# EAGLE design deska (EAGLE 9.3.0)
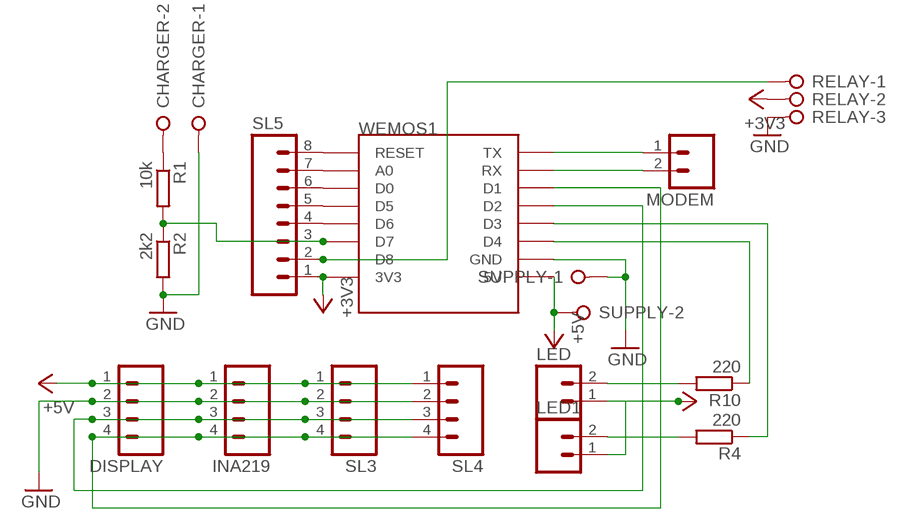
[diagram p0: schematic, sheet 1]

## Parts
CHARGER  W237-02P  [W237-132]
DISPLAY  M04  [04P]
INA219  M04  [04P]
LED  M02  [02P]
LED1  M02  [02P]
MODEM  M02  [02P]
R1  10k  R-EU_0207/10  [0207/10]
R2  2k2  R-EU_0207/10  [0207/10]
R4  220  R-EU_0207/10  [0207/10]
R10  220  R-EU_0207/10  [0207/10]
RELAY  W237-3E  [W237-3E]
SL3  M04  [04P]
SL4  M04  [04P]
SL5  M08  [08P]
SUPPLY  W237-02P  [W237-132]
WEMOS1  WEMOS-D1-MINI  [WEMOS-D1-MINI]

## Nets
+3V3: RELAY.2 SL5.1 WEMOS1.3V3
+5V: DISPLAY.1 INA219.1 LED1.1 LED.1 SL3.1 SL4.1 SUPPLY.2 WEMOS1.5V
GND: CHARGER.1 DISPLAY.2 INA219.2 R2.2 RELAY.3 SL3.2 SL4.2 SUPPLY.1 WEMOS1.GND
N$1: DISPLAY.4 INA219.4 SL3.4 SL4.4 WEMOS1.D1
N$2: DISPLAY.3 INA219.3 SL3.3 SL4.3 WEMOS1.D2
N$3: SL5.7 WEMOS1.A0
N$4: RELAY.1 SL5.2 WEMOS1.D8
N$5: CHARGER.2 R1.1
N$7: SL5.4 WEMOS1.D6
N$8: SL5.5 WEMOS1.D5
N$9: SL5.6 WEMOS1.D0
N$10: R1.2 R2.1 SL5.3 WEMOS1.D7
N$11: R10.1 WEMOS1.D4
N$12: LED.2 R10.2
N$13: SL5.8 WEMOS1.RESET
N$14: MODEM.1 WEMOS1.TX
N$15: MODEM.2 WEMOS1.RX
N$16: LED1.2 R4.2
N$17: R4.1 WEMOS1.D3

## Library data of the parts
CHARGER SUPPLY = con-wago-508:W237-02P: WAGO SREW CLAMP; OC_FARNELL: unknown; OC_NEWARK: unknown
DISPLAY INA219 SL3 SL4 = con-amp-quick:M04: AMP QUICK CONNECTOR; OC_FARNELL: unknown; OC_NEWARK: unknown
LED LED1 MODEM = con-amp-quick:M02: AMP QUICK CONNECTOR; OC_FARNELL: unknown; OC_NEWARK: unknown
R1 R2 R4 R10 = rcl:R-EU_: RESISTOR, European symbol
RELAY = con-wago-508:W237-3E: WAGO SREW CLAMP; OC_FARNELL: unknown; OC_NEWARK: unknown
SL5 = con-amp-quick:M08: AMP QUICK CONNECTOR; OC_FARNELL: unknown; OC_NEWARK: unknown
WEMOS1 = esp8266modules:WEMOS-D1-MINI: WeMos.cc D1 mini ESP8266 module

## Board
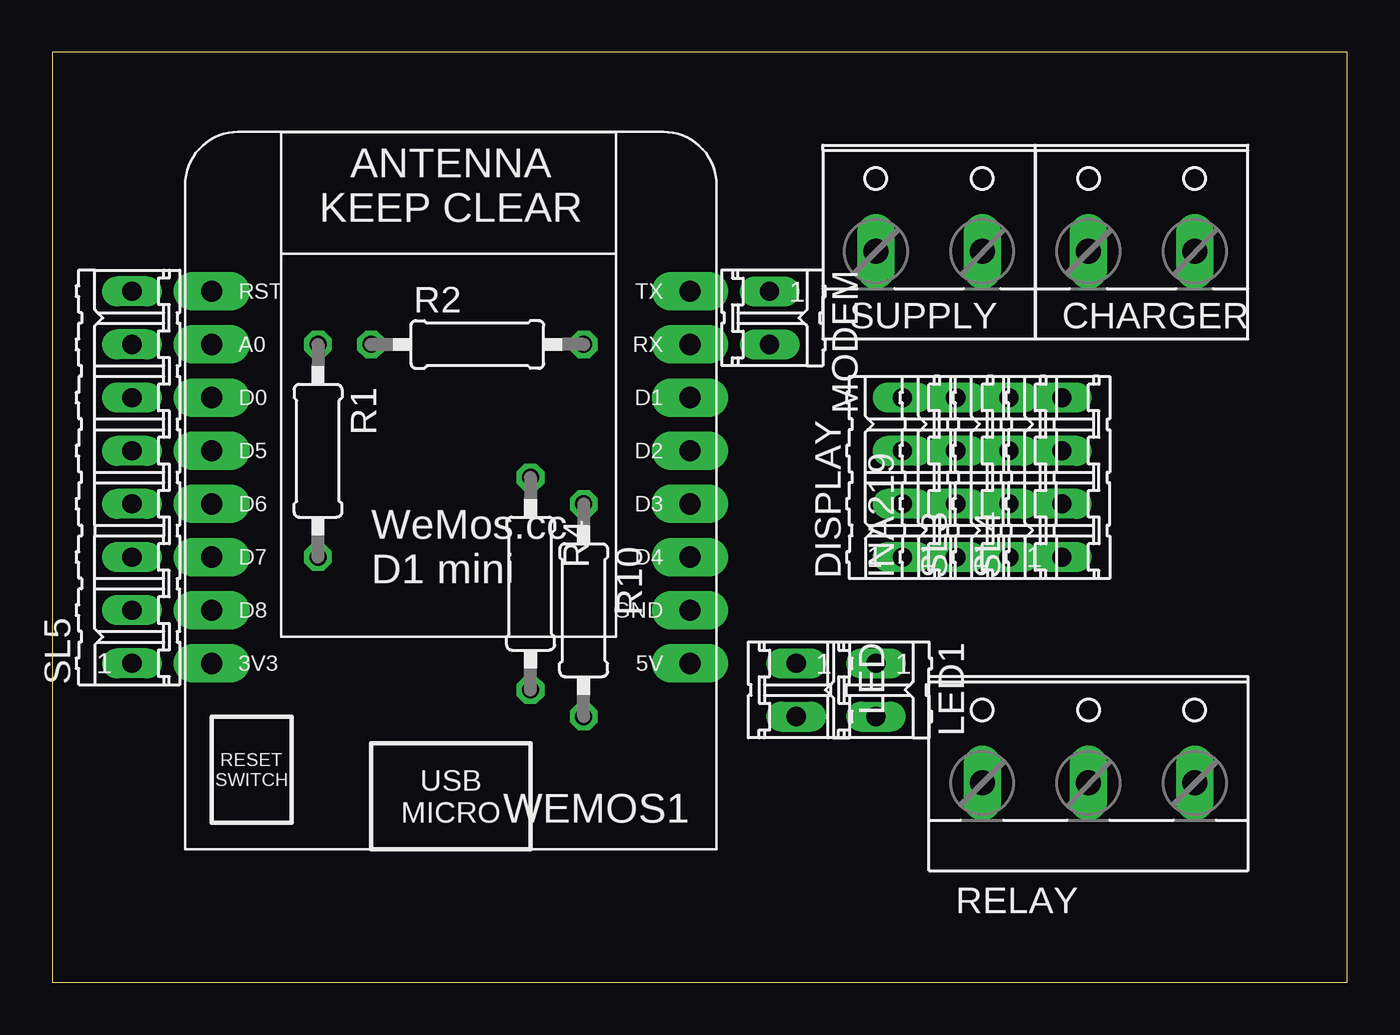
[diagram p1: board, top side]
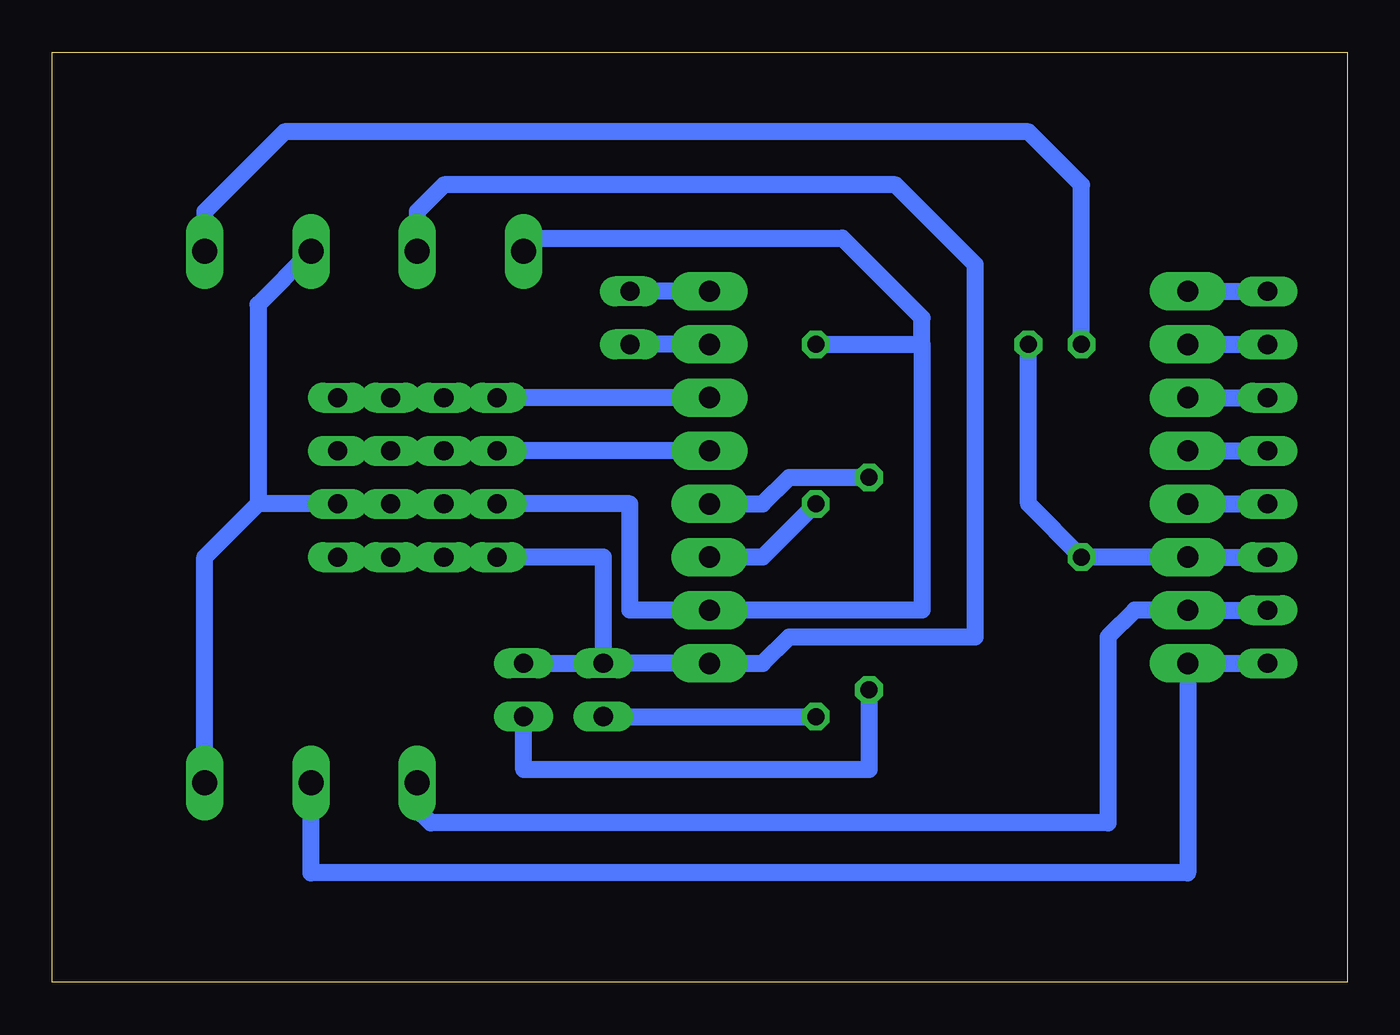
[diagram p2: board, bottom side, seen from below]

Size 61.9 x 44.44 mm. Coordinates in mm from the lower left corner, seen from the top.
Outline: 0,0 61.9,0 61.9,44.44 0,44.44 0,0
Copper layers (1*16): Top 0.035mm / dielectric 1.5mm / Bottom 0.035mm
Design rules "default": minimum track width 6mil, minimum drill 0.35mm, track to track 6mil, track to pad 6mil, pad to pad 6mil, via to via 6mil, smd to smd 6mil, copper to edge 40mil, drill to drill 6mil, minimum pad ring 10mil, minimum via ring 8mil, stop-mask expansion 4mil, vias tented up to drill 0mil, thermal gap 10mil

### Footprints (pad centres in the part's own frame; a part is rotated, then mirrored left to right if it is on the bottom)
W237-132 = drill 1.194 long: 1 -2.54,-0.635; 2 2.54,-0.635
04P = drill 0.914 long: 1 -3.81,0; 2 -1.27,0; 3 1.27,0; 4 3.81,0
02P = drill 0.914 long: 1 -1.27,0; 2 1.27,0
0207/10 = drill 0.813 octagon: 1 -5.08,0; 2 5.08,0
W237-3E = drill 1.194 long: 1 -5.08,-0.635; 2 0,-0.635; 3 5.08,-0.635
08P = drill 0.914 long: 1 -8.89,0; 2 -6.35,0; 3 -3.81,0; 4 -1.27,0; 5 1.27,0; 6 3.81,0; 7 6.35,0; 8 8.89,0
WEMOS-D1-MINI = drill 1.016 pad 1.829 long: 3V3 -10.16,-10.16; 5V 12.7,-10.16; A0 -10.16,5.08; D0 -10.16,2.54; D1 12.7,2.54; D2 12.7,0; D3 12.7,-2.54; D4 12.7,-5.08; D5 -10.16,0; D6 -10.16,-2.54; D7 -10.16,-5.08; D8 -10.16,-7.62; GND 12.7,-7.62; RESET -10.16,7.62; RX 12.7,5.08; TX 12.7,7.62

### Placement (x,y rotation side)
CHARGER  52.07,35.56 0 top
DISPLAY  40.64,24.13 90 top
INA219  43.18,24.13 90 top
LED  35.56,13.97 270 top
LED1  39.37,13.97 270 top
MODEM  34.29,31.75 270 top
R1  12.7,25.4 270 top
R2  20.32,30.48 0 top
R4  22.86,19.05 270 top
R10  25.4,17.78 270 top
RELAY  49.53,10.16 0 top
SL3  45.72,24.13 90 top
SL4  48.26,24.13 90 top
SL5  3.81,24.13 90 top
SUPPLY  41.91,35.56 0 top
WEMOS1  17.78,25.4 0 top

### Tracks (layer width: path | path; a pad name or v marks a point on that pad's centre or on a via)
+3V3
  Bottom 0.813: SL5.1 WEMOS1.3V3 7.62,5.23 49.53,5.23 RELAY.2
+5V
  Bottom 0.813: LED.1 WEMOS1.5V 27.94,15.24 26.67,16.51 17.78,16.51 17.78,34.29 21.59,38.1 43.18,38.1 44.45,36.83 SUPPLY.2 | SL4.1 SL3.1 INA219.1 DISPLAY.1 35.56,20.32 LED.1 | LED1.1 LED.1
GND
  Bottom 0.813: 20.32,30.48 20.32,17.78 WEMOS1.GND 34.29,17.78 34.29,22.86 DISPLAY.2 INA219.2 SL3.2 SL4.2 52.07,22.86 | 20.32,30.48 20.32,31.75 24.13,35.56 38.73,35.56 SUPPLY.1 | R2.2 20.32,30.48 | CHARGER.1 52.07,32.38 52.07,22.86 | RELAY.3 54.61,20.32 52.07,22.86
N$1
  Bottom 0.813: WEMOS1.D1 DISPLAY.4 INA219.4 SL3.4 SL4.4
N$2
  Bottom 0.813: WEMOS1.D2 DISPLAY.3 INA219.3 SL3.3 SL4.3
N$3
  Bottom 0.813: WEMOS1.A0 SL5.7
N$4
  Bottom 0.813: SL5.2 WEMOS1.D8 10.16,17.78 11.43,16.51 11.43,7.62 43.82,7.62 44.45,8.25 RELAY.1
N$5
  Bottom 0.813: R1.1 12.7,38.1 15.24,40.64 50.8,40.64 54.61,36.83 CHARGER.2
N$7
  Bottom 0.813: WEMOS1.D6 SL5.4
N$8
  Bottom 0.813: WEMOS1.D5 SL5.5
N$9
  Bottom 0.813: WEMOS1.D0 SL5.6
N$10
  Bottom 0.813: R2.1 15.24,22.86 R1.2 WEMOS1.D7 SL5.3
N$11
  Bottom 0.813: WEMOS1.D4 27.94,20.32 R10.1
N$12
  Bottom 0.813: LED.2 R10.2
N$13
  Bottom 0.813: WEMOS1.RESET SL5.8
N$14
  Bottom 0.813: WEMOS1.TX MODEM.1
N$15
  Bottom 0.813: WEMOS1.RX MODEM.2
N$16
  Bottom 0.813: R4.2 22.86,10.16 39.37,10.16 LED1.2
N$17
  Bottom 0.813: WEMOS1.D3 27.94,22.86 26.67,24.13 R4.1